# EasyEDA schematic 1-Schematic_Utilipi Mini.json

## Sheets
1 Périphériques: TITLE: Utilipi Mini; REV: 1.0; Date: 2019-04-29; Sheet: 2/2; Drawn By: Nathan49; Company: DIC
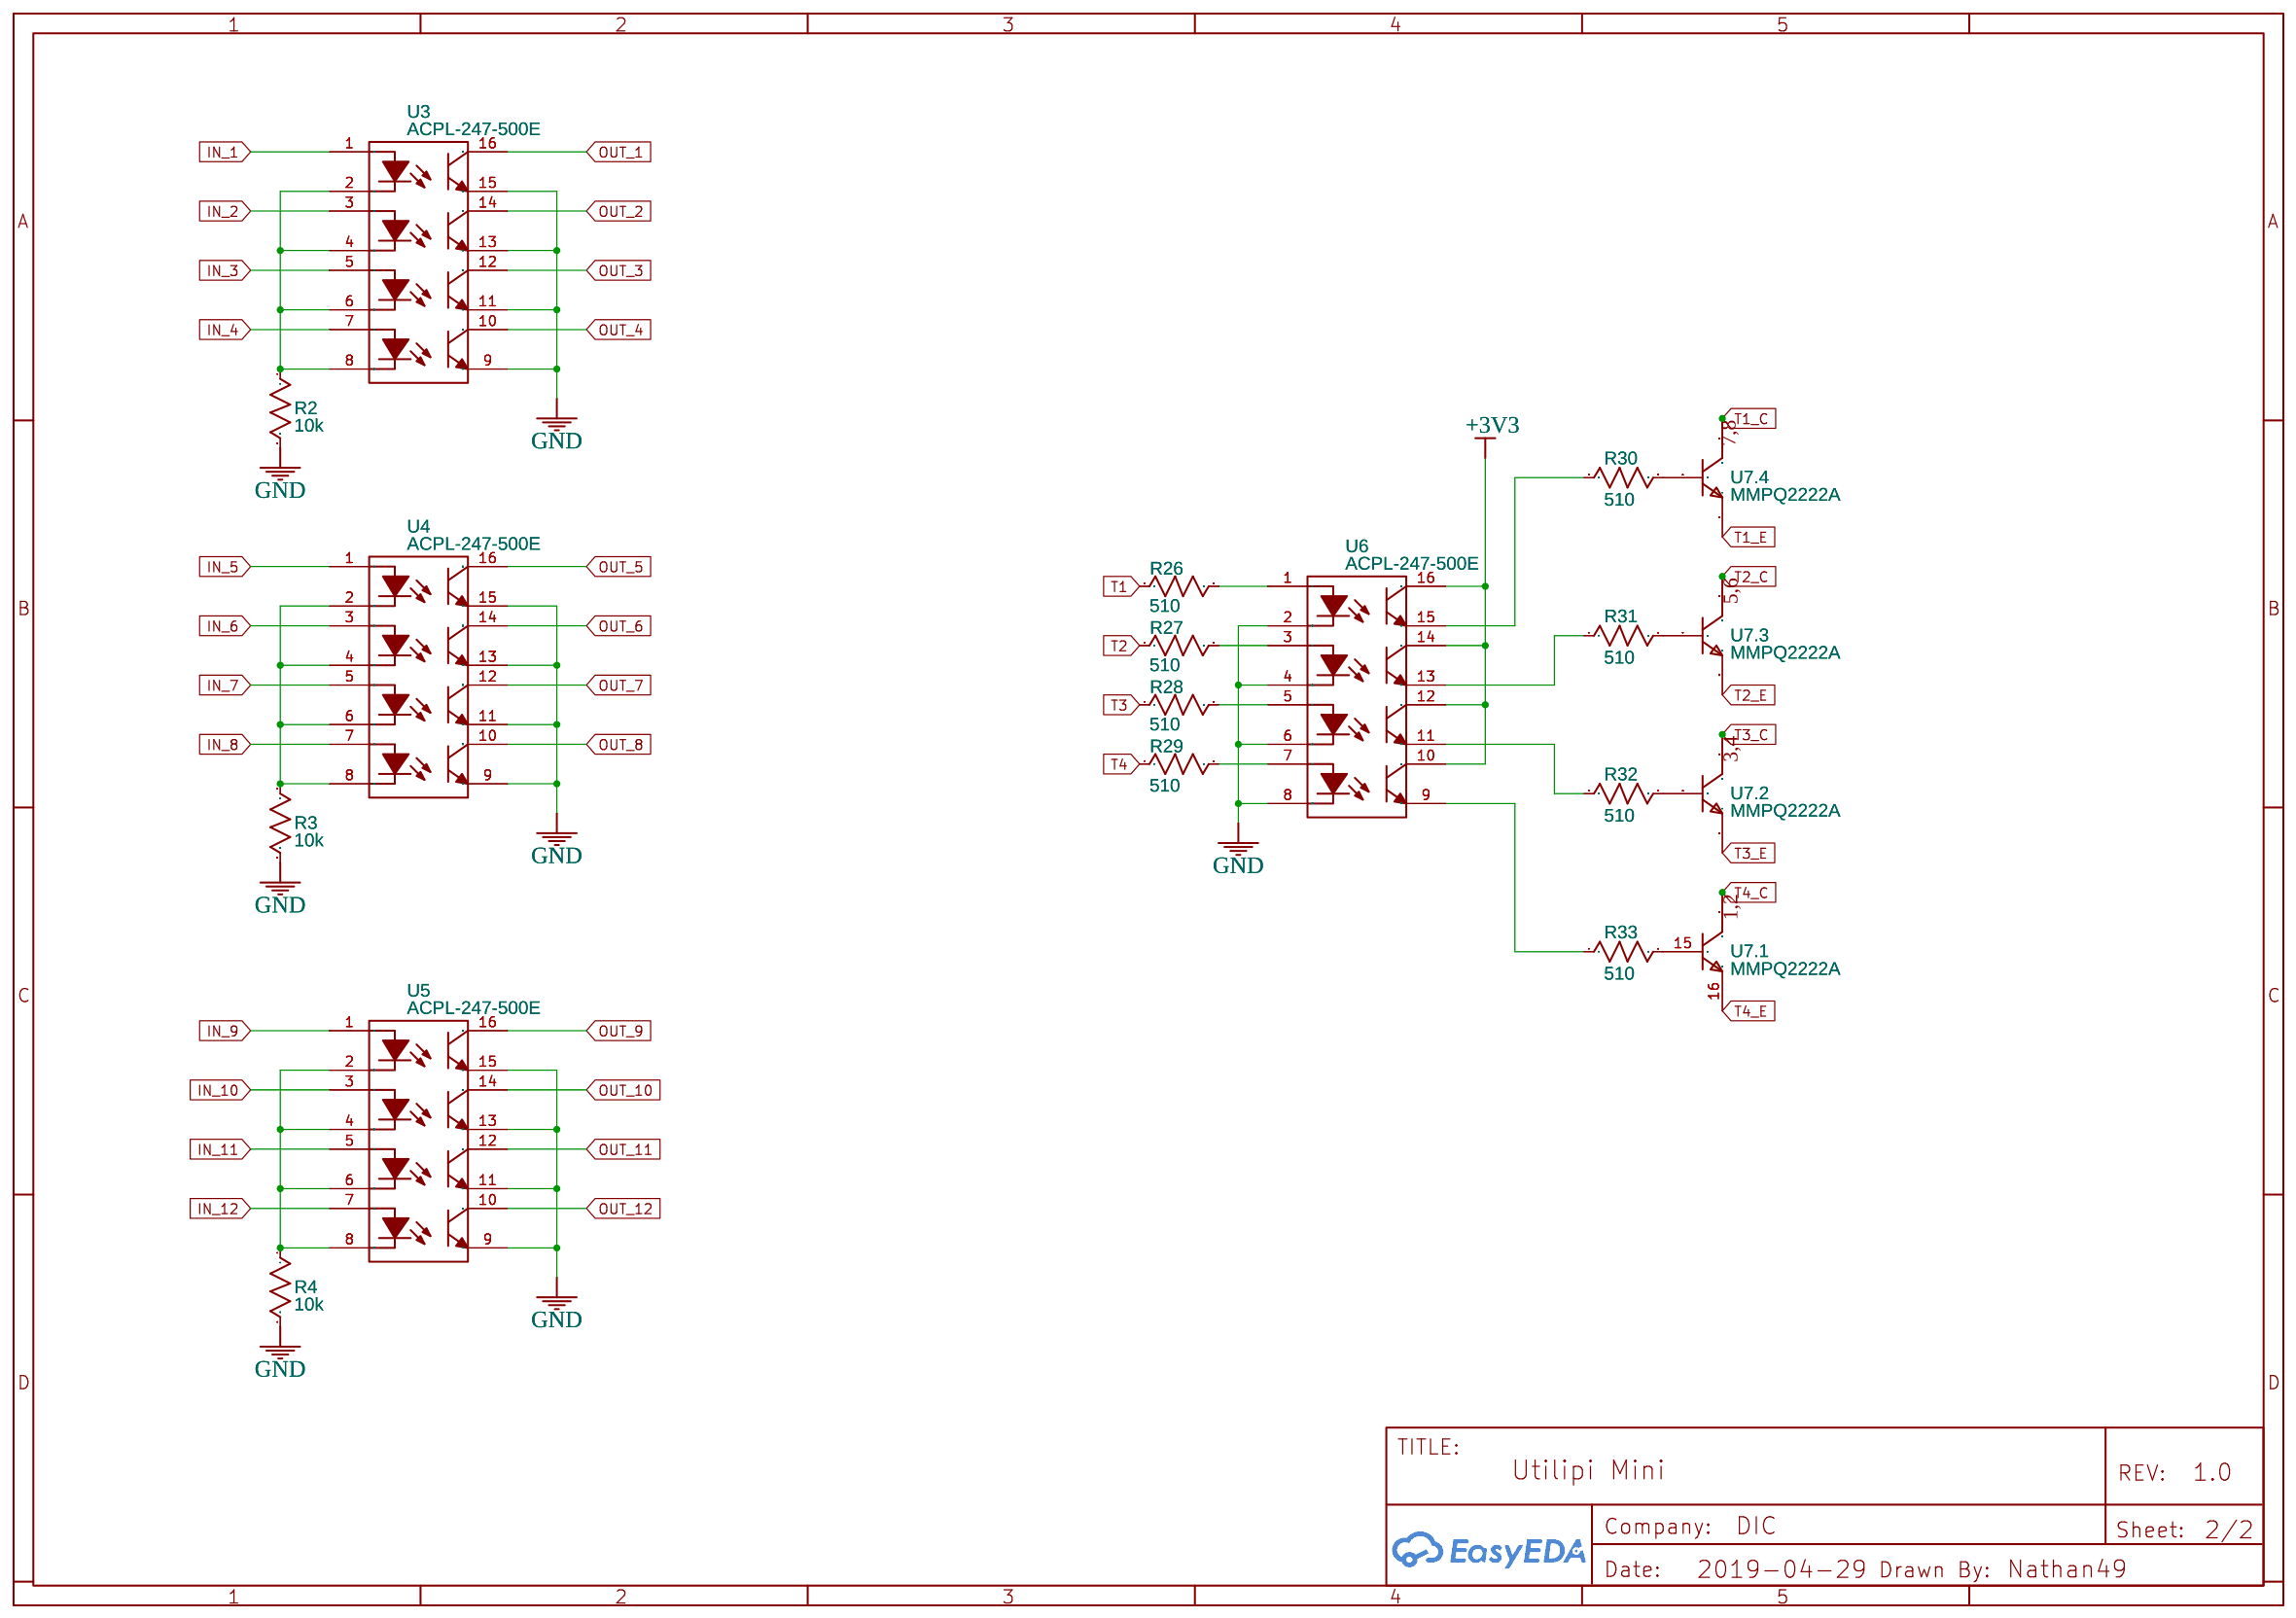
[diagram p0: Périphériques]
2 NRF52: Date: 2019-06-21; Sheet: 1/2
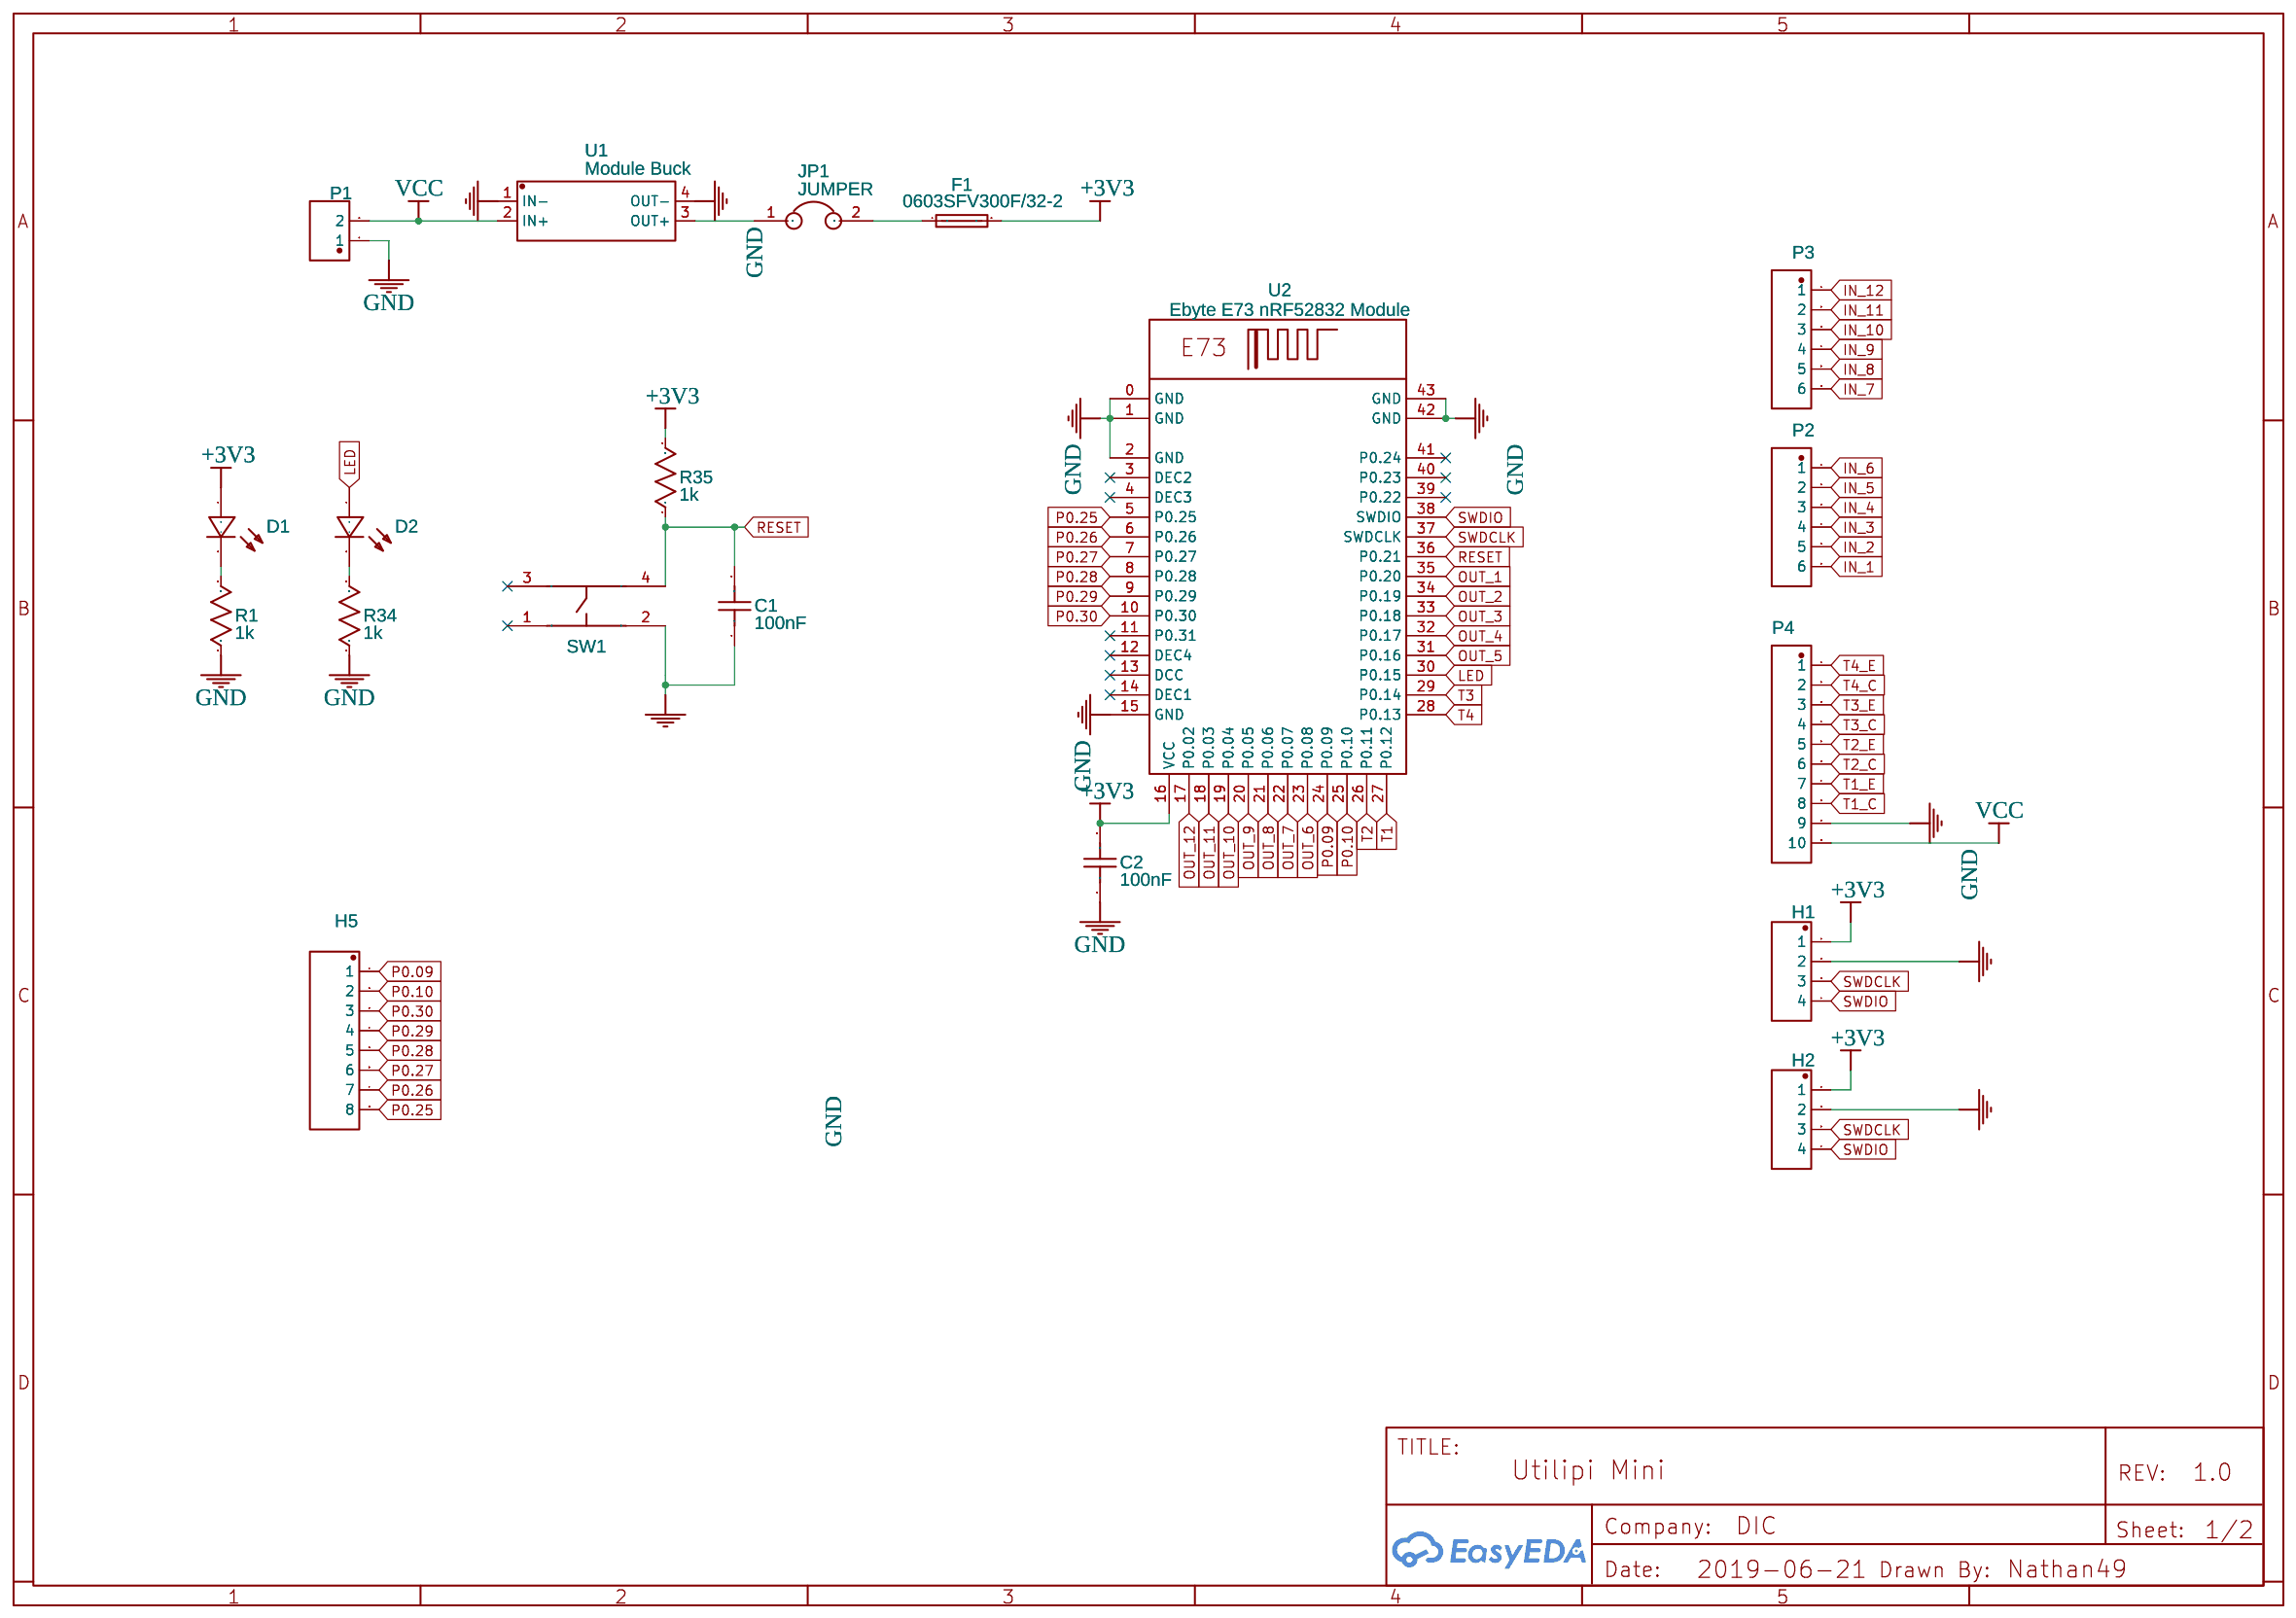
[diagram p1: NRF52]

## Parts
sheet NRF52
C1  100nF  [0805]
C2  100nF  [0805]
D1  LED-Blue(0805)  [LED-0805]
D2  LED-Blue(0805)  [LED-0805]
F1  0603SFV300F/32-2  [C0603]
H1  Header-Male-2.54_1x4  [DIP-1X4P-2.54MM-M]
H2  Header-Male-2.54_1x4  [POGO PAD]
H5  Header-Male-2.54_1x8  [SMD PAD]
JP1  JUMPER  [JUMPER2]
P1  RS PRO 2 Contacts  [RS PRO 2 CONTACTS]
P2  RS PRO 6 Contacts  [RS PRO 6 CONTACTS]
P3  RS PRO 6 Contacts  [RS PRO 6 CONTACTS]
P4  RS PRO 10 Contacts  [RS PRO 10 CONTACTS]
R1  1k  [0805]
R34  1k  [0805]
R35  1k  [0805]
SW1  PTS810SJK250SMTRLFS  [PTS810SJK250SMTRLFS]
U1  Module Buck  [BUCK CMS]
U2  Ebyte E73 nRF52832 Module  [E73-2G4M04S1B]
sheet Périphériques
R2  10k  [0805]
R3  10k  [0805]
R4  10k  [0805]
R26  510  [0805]
R27  510  [0805]
R28  510  [0805]
R29  510  [0805]
R30  510  [0805]
R31  510  [0805]
R32  510  [0805]
R33  510  [0805]
U3  ACPL-247-500E  [SOP-16]
U4  ACPL-247-500E  [SOP-16]
U5  ACPL-247-500E  [SOP-16]
U6  ACPL-247-500E  [SOP-16]
U7  MMPQ2222A  [SOIC16N]  (sections 1,2,3,4)

## Library data of the parts
C1 C2 = Cap_0805_US: Manufacturer Part: ?
D1 D2 = -: Supplier: LCSC; Manufacturer: Everlight Elec; Manufacturer Part: 17-21/BHC-XL2M2TY/3T; Supplier Part: C72035
F1 = -: Supplier: LCSC; Manufacturer Part: Glass tube fuse2A 3F 250VAC; Manufacturer: XCFuse; image: //image.lceda.cn/szlcsc/C71017.jpg; Supplier Part: C71017
H1 H2 = -: Supplier: LCSC; Manufacturer: Ckmtw; Manufacturer Part: 210S-1*4P L=11.6MMGold-plated black; Contributor: LCSC; Supplier Part: C124378
H5 = -: Supplier: LCSC; Manufacturer: Ckmtw; Manufacturer Part: 210S-1*8P L=11.6MMGold-plated black; Contributor: LCSC; Supplier Part: C124381
JP1 = -: Contributor: KiCad
P1 = -: Contributor: Nathan49; Supplier Part: 897-1026; Supplier: RS-Online; Manufacturer: 897-0998
P2 P3 = -: Manufacturer Part: ?; Contributor: Nathan49; Supplier Part: 874-5170; Supplier: RS-Online; Manufacturer: 897-1017
P4 = -: Manufacturer Part: ?; Contributor: Nathan49; Supplier Part: https://fr.aliexpress.com/store/product/10P-Plug-component-Pitch-3-50mm-10Pins-right-angle-pin-instead-of-PHOENIX-CONTACT-MC-1/938180_32591204066.html?spm=a2g0w.12010612.8148356.17.564666b9JPgQYm
R1 R34 = Res_0805(1/8W)_US: Manufacturer Part: ?
R2-R4 R26-R33 R35 = Res_1206(1/4W)_US: Manufacturer Part: ?
SW1 = -: Supplier: LCSC; Supplier Part: C221896; Manufacturer: C&K; Contributor: LCSC
U1 = -: Manufacturer Part: ?; Supplier: Ali express; Supplier Part: https://fr.aliexpress.com/item/mini-DC-DC-Converter-Step-Down-buck-Power-Supply-Module-for-Flight-Control-Car/2038556858.html?spm=a2g0s.9042311.0.0.5bf36c37EOK96X
U2 = -: Manufacturer: EBYTE; Supplier Part: undefined; Supplier: Aliexpress; Contributor: fbeer57; Link: https://www.aliexpress.com/item/CDEBYTE-E73-2G4M04S-BLE-4-2-5-0-long-distance-100m-2-4GHz-SMD-ARM-Core/32820692238.html
U3-U6 = -: Supplier: RS-Online; Manufacturer: ISOCOM; LCSC: C83832; Contributor: LCSC; Supplier Part: 693-6807
U7 = -: Quad General Purpose Transistor NPN Silicon; Manufacturer Part: ?; Supplier: RS-Online; Supplier Part: 807-4850

## Nets
+3V3: C2.2 D1.1(+) F1.2 H1.1 H2.1 R35.2 U2.16(VCC) U6.10(COL) U6.12(COL) U6.14(COL) U6.16(COL)
GND: C1.1 C2.1 H1.2 H2.2 P1.1 P4.9 R1.1 R2.2 R3.2 R4.2 R34.1 SW1.2 U1.1(IN-) U1.4(OUT-) U2.0(GND) U2.1(GND) U2.2(GND) U2.15(GND) U2.42(GND) U2.43(GND) U3.9(EM) U3.11(EM) U3.13(EM) U3.15(EM) U4.9(EM) U4.11(EM) U4.13(EM) U4.15(EM) U5.9(EM) U5.11(EM) U5.13(EM) U5.15(EM) U6.2(CAT) U6.4(CAT) U6.6(CAT) U6.8(CAT)
VCC: P1.2 P4.10 U1.2(IN+)
IN_1: P2.6 U3.1(AN)
IN_2: P2.5 U3.3(AN)
IN_3: P2.4 U3.5(AN)
IN_4: P2.3 U3.7(AN)
IN_5: P2.2 U4.1(AN)
IN_6: P2.1 U4.3(AN)
IN_7: P3.6 U4.5(AN)
IN_8: P3.5 U4.7(AN)
IN_9: P3.4 U5.1(AN)
IN_10: P3.3 U5.3(AN)
IN_11: P3.2 U5.5(AN)
IN_12: P3.1 U5.7(AN)
LED: D2.1(+) U2.30(P0.15)
OUT_1: U2.35(P0.20) U3.16(COL)
OUT_2: U2.34(P0.19) U3.14(COL)
OUT_3: U2.33(P0.18) U3.12(COL)
OUT_4: U2.32(P0.17) U3.10(COL)
OUT_5: U2.31(P0.16) U4.16(COL)
OUT_6: U2.23(P0.08) U4.14(COL)
OUT_7: U2.22(P0.07) U4.12(COL)
OUT_8: U2.21(P0.06) U4.10(COL)
OUT_9: U2.20(P0.05) U5.16(COL)
OUT_10: U2.19(P0.04) U5.14(COL)
OUT_11: U2.18(P0.03) U5.12(COL)
OUT_12: U2.17(P0.02) U5.10(COL)
P0.09: H5.1 U2.24(P0.09)
P0.10: H5.2 U2.25(P0.10)
P0.25: H5.8 U2.5(P0.25)
P0.26: H5.7 U2.6(P0.26)
P0.27: H5.6 U2.7(P0.27)
P0.28: H5.5 U2.8(P0.28)
P0.29: H5.4 U2.9(P0.29)
P0.30: H5.3 U2.10(P0.30)
RESET: C1.2 R35.1 SW1.4 U2.36(P0.21)
SWDCLK: H1.3 H2.3 U2.37(SWDCLK)
SWDIO: H1.4 H2.4 U2.38(SWDIO)
T1: R26.1 U2.27(P0.12)
T1_C: P4.8 U7.7(C) U7.8(C)
T1_E: P4.7 U7.10(E)
T2: R27.1 U2.26(P0.11)
T2_C: P4.6 U7.5(C) U7.6(C)
T2_E: P4.5 U7.12(E)
T3: R28.1 U2.29(P0.14)
T3_C: P4.4 U7.3(C) U7.4(C)
T3_E: P4.3 U7.14(E)
T4: R29.1 U2.28(P0.13)
T4_C: P4.2 U7.1(C) U7.2(C)
T4_E: P4.1 U7.16(E)
Net-(D1-2): D1.2(-) R1.2
Net-(D2-2): D2.2(-) R34.2
Net-(F1-1): F1.1 JP1.2
Net-(JP1-1): JP1.1 U1.3(OUT+)
Net-(R2-1): R2.1 U3.2(CAT) U3.4(CAT) U3.6(CAT) U3.8(CAT)
Net-(R3-1): R3.1 U4.2(CAT) U4.4(CAT) U4.6(CAT) U4.8(CAT)
Net-(R4-1): R4.1 U5.2(CAT) U5.4(CAT) U5.6(CAT) U5.8(CAT)
Net-(R26-2): R26.2 U6.1(AN)
Net-(R27-2): R27.2 U6.3(AN)
Net-(R28-2): R28.2 U6.5(AN)
Net-(R29-2): R29.2 U6.7(AN)
Net-(R30-1): R30.1 U6.15(EM)
Net-(R30-2): R30.2 U7.9(B)
Net-(R31-1): R31.1 U6.13(EM)
Net-(R31-2): R31.2 U7.11(B)
Net-(R32-1): R32.1 U6.11(EM)
Net-(R32-2): R32.2 U7.13(B)
Net-(R33-1): R33.1 U6.9(EM)
Net-(R33-2): R33.2 U7.15(B)

Not connected (* = marked no-connect by the designer): SW1 1* 3*; U2 3(DEC2)* 4(DEC3)* 11(P0.31)* 12(DEC4)* 13(DCC)* 14(DEC1)* 39(P0.22)* 40(P0.23)* 41(P0.24)*
